# EAGLE design sensor_v5_no_gnd (EAGLE 7.1.0)
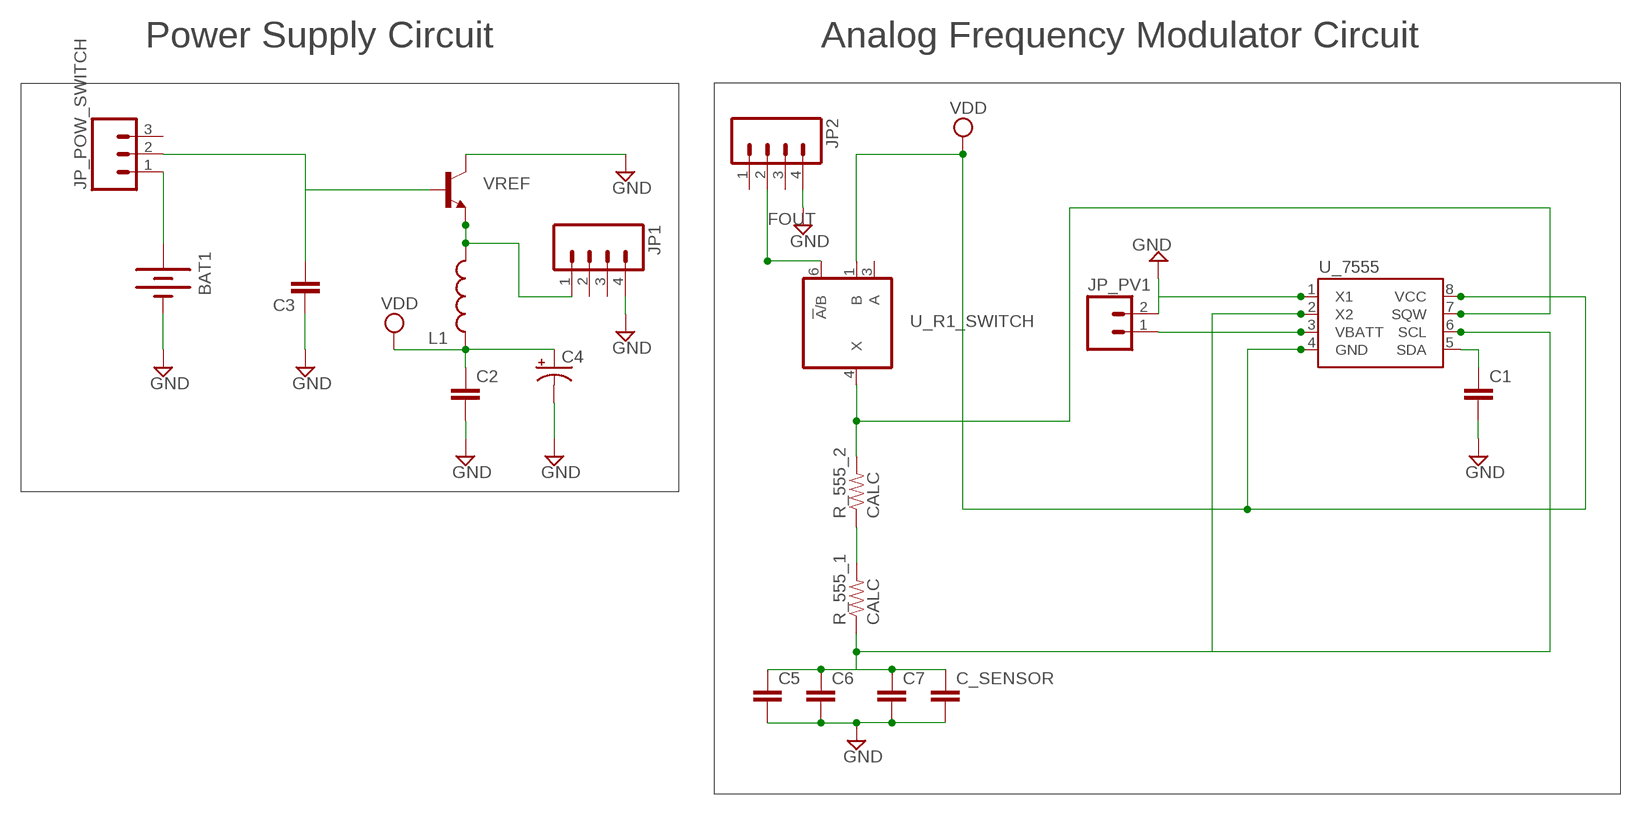
[diagram p0: schematic, sheet 1]

## Parts
BAT1  BATTERY20PTH_LAB  [BATTCOM_20MM_PTH]
C1  CAP0603-CAP  [0603-CAP]
C2  CAP0603-CAP  [0603-CAP]
C3  CAP0603-CAP  [0603-CAP]
C4  CAP_POL1206  [EIA3216]
C5  CAP0805  [0805]
C6  CAP0805  [0805]
C7  CAP0805  [0805]
C_SENSOR  CAP0805  [0805]
JP1  M04LOCK  [1X04_LOCK]
JP2  M04LOCK  [1X04_LOCK]
JP_POW_SWITCH  M03LOCK  [1X03_LOCK]
JP_PV1  M02LOCK  [1X02_LOCK]
L1  INDUCTOR0603  [0603]
R_555_1  CALC  RESISTOR0805-RES  [0805]
R_555_2  CALC  RESISTOR0805-RES  [0805]
U_7555  DS1307SO8  [SO08]
U_R1_SWITCH  741G3157DCKR  [DCK_R-PDSO-G6]
U_VREF  TRANSISTOR_NPNSOT23-3  [SOT23-3]

## Nets
FOUT: JP2.2 JP_PV1.1 U_7555.3(VBATT) U_R1_SWITCH.6(!A!/B)
GND: BAT1.2(-) C1.2 C2.2 C3.1 C4.C(-) C5.2 C6.2 C7.2 C_SENSOR.2 JP1.4 JP2.4 JP_PV1.2 U_7555.1(X1) U_VREF.3(C)
N$6: BAT1.1(+) JP_POW_SWITCH.1
N$9: R_555_1.2 R_555_2.1
P2: C5.1 C6.1 C7.1 C_SENSOR.1 R_555_1.1 U_7555.2(X2) U_7555.6(SCL)
P5: C1.1 U_7555.5(SDA)
P7: R_555_2.2 U_7555.7(SQW) U_R1_SWITCH.4(X)
VDD: C2.1 C4.A(+) L1.1 U_7555.4(GND) U_7555.8(VCC) U_R1_SWITCH.1(B)
VREFIN: C3.2 JP_POW_SWITCH.2 U_VREF.1(B)
VREFOUT: JP1.1 L1.2 U_VREF.2(E)
Unconnected: JP1.2 JP1.3 JP2.1 JP2.3 JP_POW_SWITCH.3 U_R1_SWITCH.3(A)

## Notes on the sheet
- Power Supply Circuit | Analog Frequency Modulator Circuit
- VREF

## Power pins joined to a net without a drawn wire
GND: U_R1_SWITCH.2(GND)
VCC: U_R1_SWITCH.5(VCC)

## Library data of the parts
BAT1 = semipassiveTag_library:BATTERY: Battery Holders Various common sizes : AA, AAA, 20mm coin cell and 12mm coin cell.
C1-C3 = SparkFun-Capacitors:CAP: Capacitor Standard 0603 ceramic capacitor, and 0.1" leaded capacitor.
C4 = SparkFun-Capacitors:CAP_POL: Capacitor Polarized These are standard SMD and PTH capacitors. Normally 10uF, 47uF, and 100uF in electrolytic and tantalum varieties. Always verify the external diameter of the through hole cap, it varies with capacity, voltage, and manufacturer. The EIA devices should be standard.
C5-C7 C_SENSOR = SparkFun:CAP: Capacitor Standard 0603 ceramic capacitor, and 0.1" leaded capacitor.
JP1 JP2 = SparkFun-Connectors:M04: Header 4 Standard 4-pin 0.1" header. Use with straight break away headers (SKU : PRT-00116), right angle break away headers (PRT-00553), swiss pins (PRT-00743), machine pins (PRT-00117), and female headers (PRT-00115). Molex polarized connector foot print use with SKU : PRT-08231 with associated crimp pins and housings. 1MM SMD Version SKU: PRT-10208
JP_POW_SWITCH = SparkFun-Connectors:M03: Header 3 Standard 3-pin 0.1" header. Use with straight break away headers (SKU : PRT-00116), right angle break away headers (PRT-00553), swiss pins (PRT-00743), machine pins (PRT-00117), and female headers (PRT-00115). Molex polarized connector foot print use with SKU : PRT-08232 with associated crimp pins and housings.
JP_PV1 = SparkFun-Connectors:M02: Header 2 Standard 2-pin 0.1" header. Use with straight break away headers (SKU : PRT-00116), right angle break away headers (PRT-00553), swiss pins (PRT-00743), machine pins (PRT-00117), and female headers (PRT-00115). Molex polarized connector foot print use with SKU : PRT-08233 with associated crimp pins and housings.
L1 = SparkFun-Passives:INDUCTOR: Inductors Basic Inductor/Choke - 0603 and 1206. Footprints are not proven and vary greatly between part numbers.
R_555_1 R_555_2 = SparkFun-Resistors:RESISTOR: Resistor Basic schematic elements and footprints for 0603, 1206, and PTH resistors.
U_7555 = SparkFun-FreqCtrl:DS1307: I2C real-time clock with battery backup.
U_R1_SWITCH = 74xx-little-de:74*1G3157: Single-Pole, Double-Throw Analog Switch Source: http://focus.ti.com/lit/ds/symlink/sn74lvc1g3157.pdf
U_VREF = SparkFun:TRANSISTOR_NPN: Transistor NPN BJT configuration in SOT23 package. MMBT2222 is the common NPN we use. Double check BCE configuration again layout.

## Board
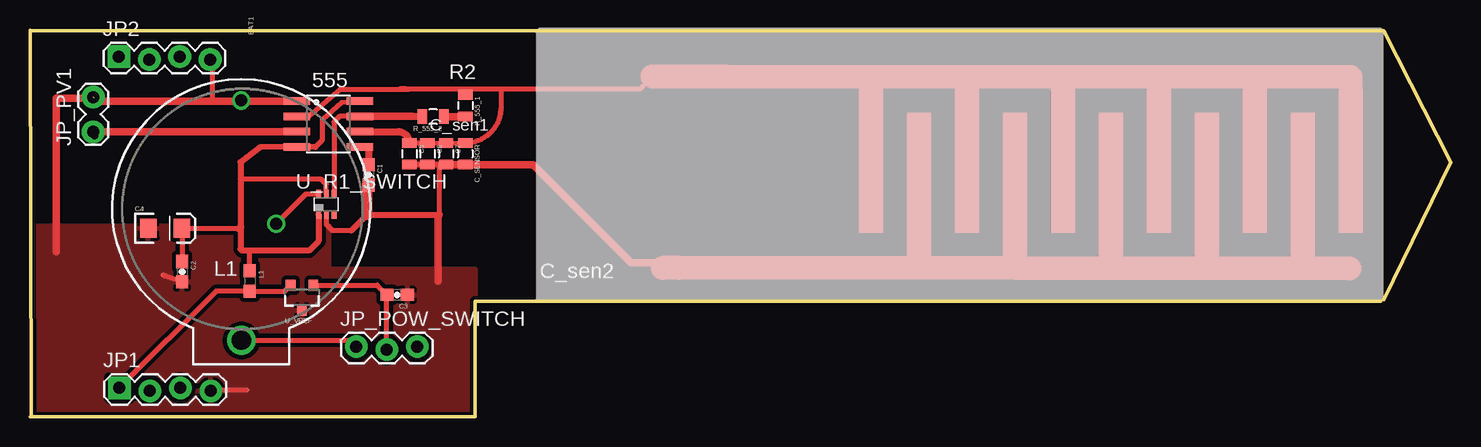
[diagram p1: board, top side]
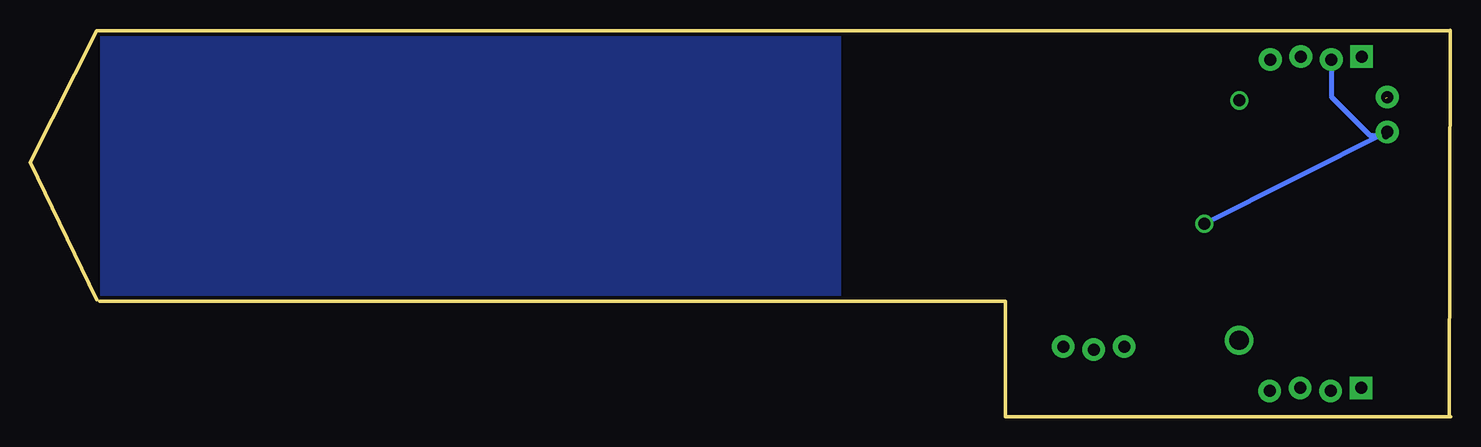
[diagram p2: board, bottom side, seen from below]

Size 118.42 x 32.25 mm. Coordinates in mm from the lower left corner, seen from the top.
Outline: 112.84,32.17 118.42,21.22 112.86,9.75
Outline: 0.04,32.25 0.12,0.19
Outline: 112.86,32.19 0.04,32.2
Outline: 0,0 37.1,0 37.1,9.65 112.6,9.65
Copper layers (1*16): Top 0.035mm / dielectric 1.5mm / Bottom 0.035mm
Design rules "Fusion_eagle_rule_v1.1 *": minimum track width 12mil, minimum drill 12mil, track to track 14mil, track to pad 14mil, pad to pad 14mil, via to via 14mil, smd to smd 0mil, copper to edge 10mil, drill to drill 10mil, minimum pad ring 10mil, minimum via ring 6mil, stop-mask expansion 2mil, vias tented up to drill 100mil, thermal gap 10mil

### Footprints (pad centres in the part's own frame; a part is rotated, then mirrored left to right if it is on the bottom)
BATTCOM_20MM_PTH = drill 1.6: 1 19.99,0 | drill 1: 2 0,0
0603-CAP = smd 1.1 x 1: 1 -0.85,0; 2 0.85,0
EIA3216 = smd 1.4 x 1.6: A 1.4,0; C -1.4,0
0805 = smd 0.8 x 1.2: 1 -0.9,0; 2 0.9,0
1X04_LOCK = drill 1.016 pad 1.88 square: 1 0,0.127 | drill 1.016 pad 1.88: 2 2.54,-0.127; 3 5.08,0.127; 4 7.62,-0.127
1X03_LOCK = drill 1 pad 1.88: 1 0,0.127; 2 2.54,-0.127; 3 5.08,0.127
1X02_LOCK = drill 1 pad 1.88: 1 -0.178,0; 2 2.718,0
0603 = smd 1.1 x 1: 1 -0.85,0; 2 0.85,0
SO08 = smd 0.61 x 2.21: 1 -1.905,-2.616; 2 -0.635,-2.616; 3 0.635,-2.616; 4 1.905,-2.616; 5 1.905,2.616; 6 0.635,2.616; 7 -0.635,2.616; 8 -1.905,2.616
DCK_R-PDSO-G6 = smd 0.4 x 0.7: 1 -0.65,-0.85; 2 0,-0.85; 3 0.65,-0.85; 4 0.65,0.85; 5 0,0.85; 6 -0.65,0.85
SOT23-3 = smd 0.8 x 0.9: 1 -0.95,-1; 2 0.95,-1; 3 0,1.1

### Placement (x,y rotation side)
BAT1  17.62,26.37 270 top
C1  28.23,20.18 270 top
C2  12.68,12.11 270 top
C3  30.62,10.17 180 top
C4  11.27,15.73 0 top
C5  31.63,21.94 270 top
C6  33.13,21.94 270 top
C7  34.69,21.93 270 top
C_SENSOR  36.28,21.94 270 top
JP1  7.45,2.3 0 top
JP2  7.4,29.9 0 top
JP_POW_SWITCH  27.2,5.74 0 top
JP_PV1  5.27,23.94 90 top
L1  18.33,11.33 270 top
R_555_1  36.3,25.95 270 top
R_555_2  33.6,25.03 180 top
U_7555  24.87,24.41 270 top
U_R1_SWITCH  24.7,17.73 0 top
U_VREF  22.68,9.98 180 top

### Tracks (layer width: path | path; a pad name or v marks a point on that pad's centre or on a via)
FOUT  (via drill 0.6, 1)
  Top 0.4: U_R1_SWITCH.6 22.98,18.58 v20.51,16.11
  Top 0.406: 5.28,23.78 5.1,23.78 5.1,23.55 5.4,23.55 v5.4,23.45
  Top 0.61: 22.24,23.77 arc45 U_7555.3 5.28,23.78 JP_PV1.1
  Bottom 0.406: v20.51,16.11 JP_PV1.1 | v5.4,23.45 6.7,23.45 9.9,26.65 9.9,29.73 JP2.2
GND  (1 unrouted)
  Top 0.4: 25.19,15.55 24.7,16.04 U_R1_SWITCH.2
  Top 0.406: C5.2 34.1,21.04 34.1,16.85 | 25.19,15.55 26.8,15.55 | C2.2 11.19,11.76 11.1,11.85 | 15,2.25 18.1,2.25 | JP2.4 15.2,29.77 15.2,26.32
  Top 0.5: C5.2 C6.2 C7.2 C_SENSOR.2 | 34.1,16.85 28.1,16.85 26.8,15.55
  Top 0.61: C7.2 41.92,21.03 50.1,12.85 53.67,12.85 54.1,12.42 | BAT1.2 17.67,26.32 U_7555.1 15.2,26.32 5.4,26.32 5.4,26.55 2.2,26.55 2.2,17.05 2.2,16.85 2.2,13.75 | 34.04,11.32 34.04,16.79 34.1,16.85
  Top 0.813: C1.2 28.1,19.33 28.1,16.85
  Top 2: 110.01,12.37 54.1,12.42 52.76,12.42
  pour Top: -1,15.95 24.9,15.95 24.9,12.35 37.1,12.35 37,-2.55 -1.1,-2.55
N$4
  Top 0.4: 24.68,19.36 24.68,19.41 24.26,19.83
  Top 0.406: 24.26,19.83 17.53,19.83 17.53,19.84
N$5
  Top 0.4: 24.69,18.62 24.69,19.4
N$6
  Top 0.406: BAT1.1 26.68,6.38 JP_POW_SWITCH.1
N$9
  Top 0.61: R_555_2.1 36.3,25.03 R_555_1.2
N$10
  pour Bottom: 51,32.05 112.4,32.05 112.4,9.75 51,9.75
P2
  Top 0.3: 31.3,27.34 31.32,27.34 31.33,27.33 31.33,27.35 31.35,27.37
  Top 0.406: 22.33,25.02 22.2,25.02 U_7555.2 23.22,25.02 25.9,27.33 31.6,27.33 31.3,27.34 | 57.52,27.87 57.32,28.07 57.32,28.36 58.01,28.36 58.02,28.37 | C5.1 C6.1 C7.1 | C7.1 C_SENSOR.1 arc90 39.3,25.86 39.3,27.34 | 34.15,22.85 C7.1 | 31.32,27.34 36.4,27.34 | 36.4,27.34 39.3,27.34 | 39.3,27.34 50.85,27.34 51.88,28.37 | 31.3,27.34 32.9,27.34 32.9,27.35 38.08,27.35 | 31.3,27.34 30.85,27.34 | R_555_1.1 36.4,26.85 36.4,27.34
  Top 0.6: U_7555.6 30.69,23.78 arc-90 C5.1
  Top 2: 110.1,27.38 110.1,28.32 58.02,28.37 51.88,28.37
P5
  Top 0.406: U_7555.5 28.23,22.51
  Top 0.6: 28.23,22.51 C1.1
P7
  Top 0.406: U_7555.7 25.8,25.05 25.35,24.6 U_R1_SWITCH.4
  Top 0.61: U_7555.7 31.9,25.05 R_555_2.2
VDD
  Top 0.406: U_7555.4 23.81,22.51 24.39,23.09 24.39,24.81 26,26.21 26.79,26.29 U_7555.8 | 17.42,15.68 17.38,15.73 C4.A 12.68,15.73 C2.1 | L1.1 18.33,13.73 18.2,13.86
  Top 0.5: 23.81,22.51 19.21,22.49 17.55,21.23 17.55,15.81 17.55,13.98 17.67,13.86 18.2,13.86 23.25,13.86 24.05,14.66 U_R1_SWITCH.1
  Top 0.61: 17.42,15.68 17.55,15.81
VREFIN
  Top 0.406: U_VREF.1 28.95,10.98 C3.2 29.74,10.14 JP_POW_SWITCH.2
VREFOUT
  Top 0.406: U_VREF.2 21.24,10.48 L1.2 15.51,10.48 JP1.1
(copper drawn outside any net)
  shapes: Top area x11

### Text on the board
tPlace: R2 | 555 | C_sen1 | L1 | C_sen2